# EAGLE design Schéma Ampli n°6 (EAGLE 7.6.0)
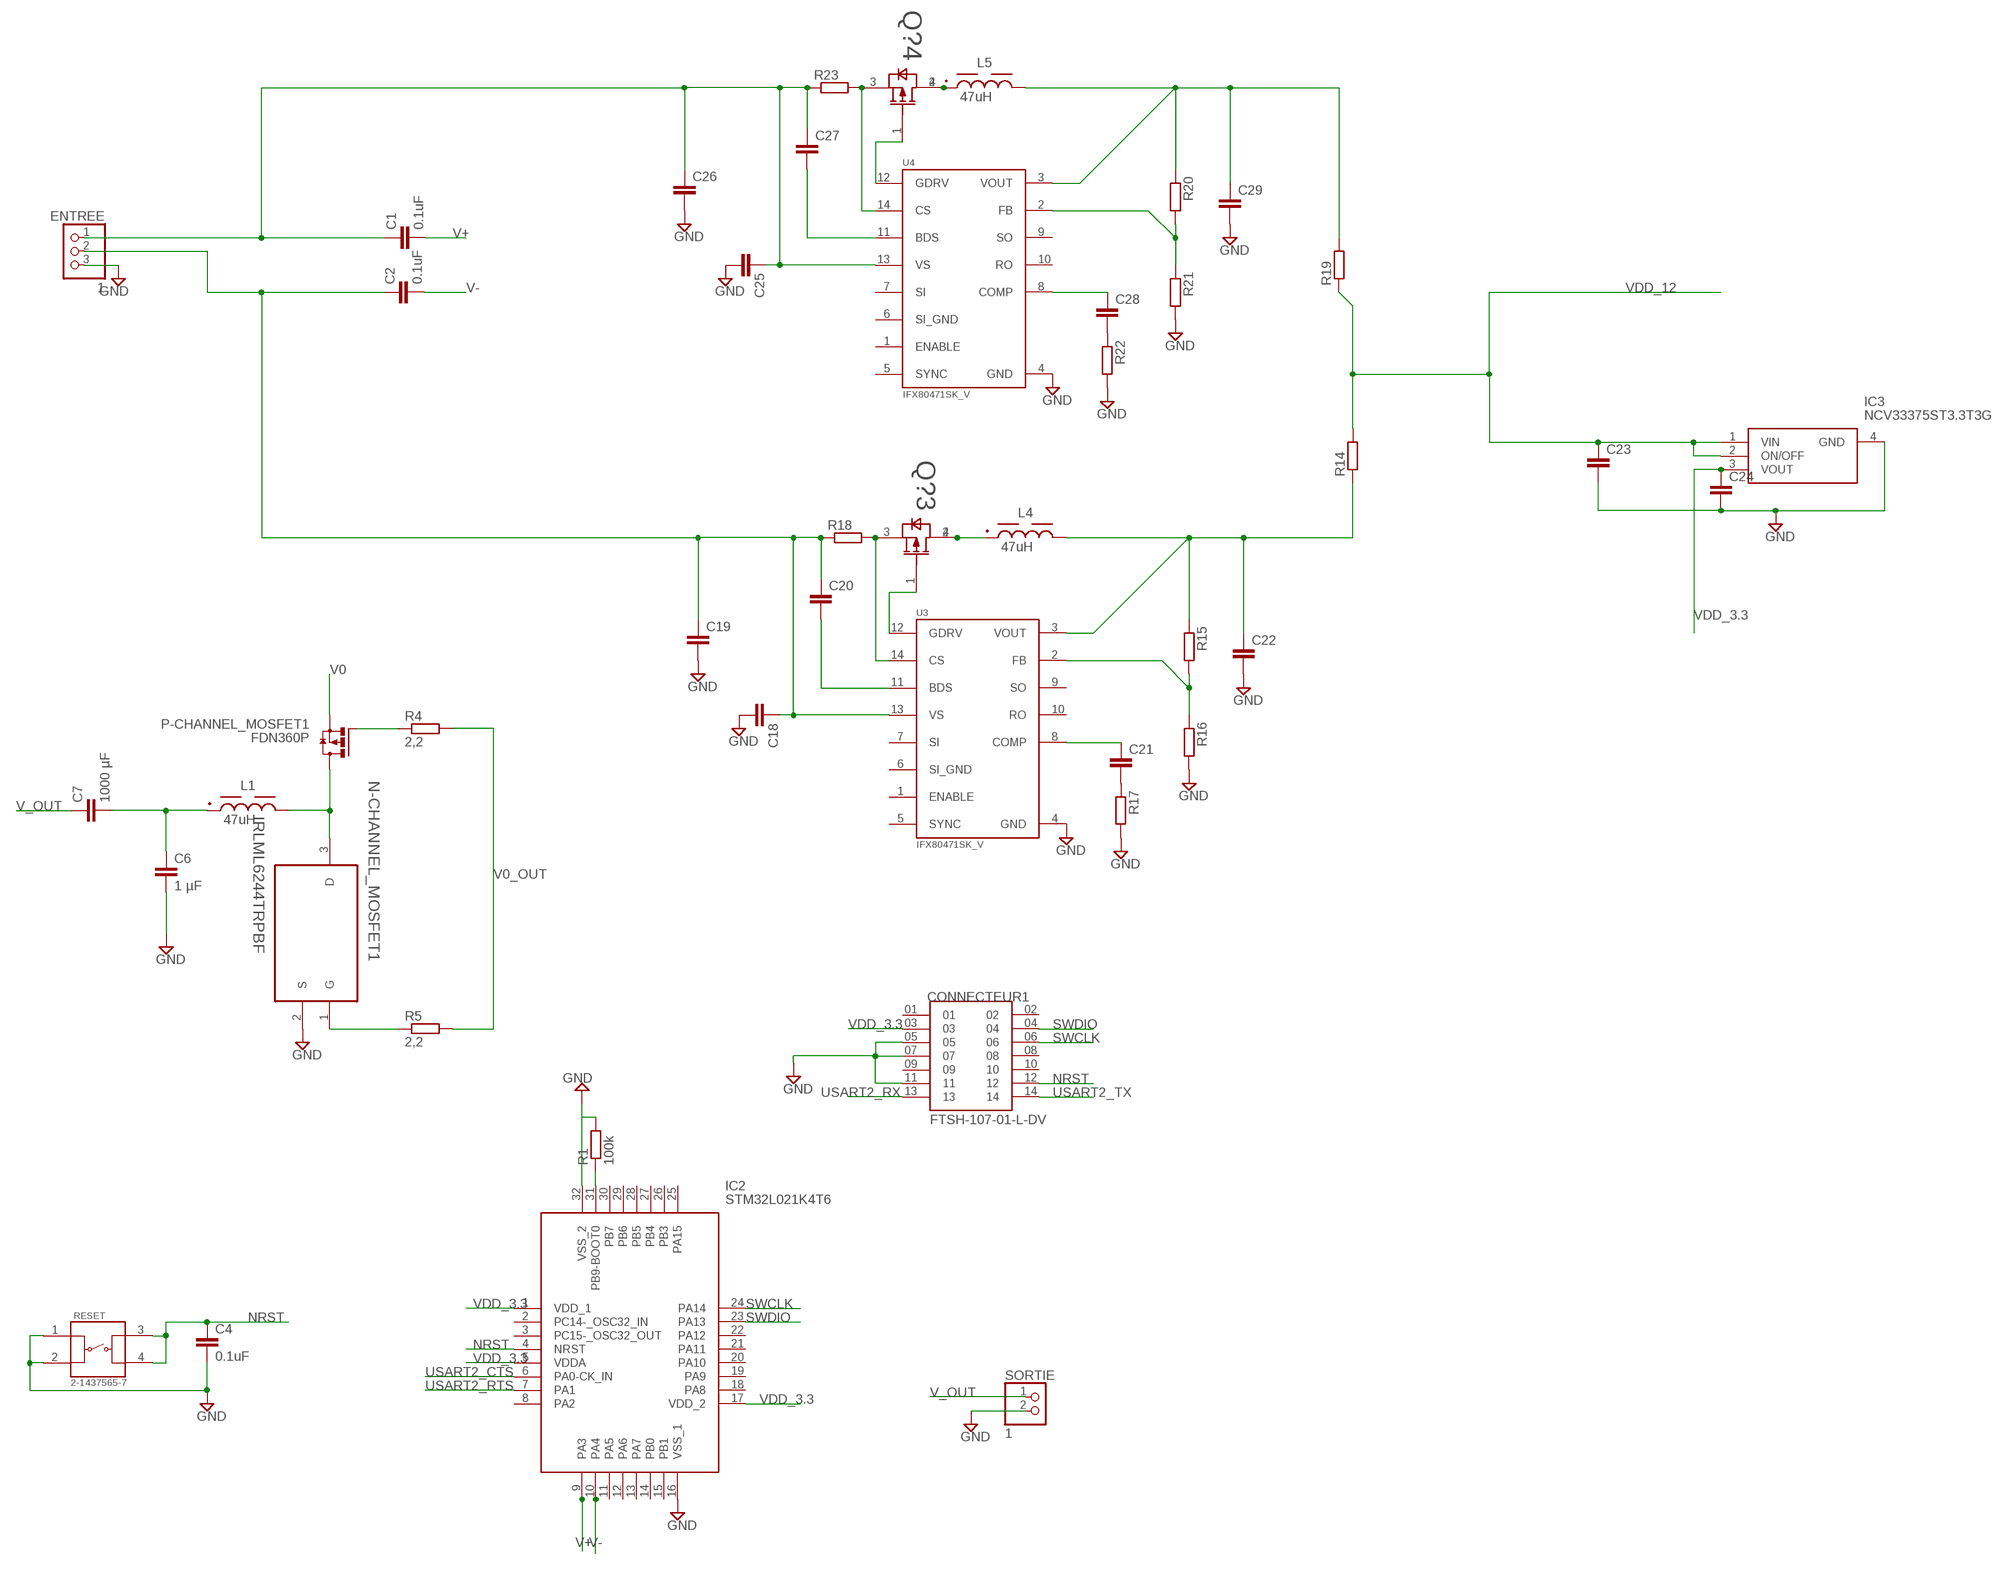
[diagram p0: schematic, sheet 1]

## Parts
C1  0.1uF  C-EUC0603  [C0603]
C2  0.1uF  C-EUC0603  [C0603]
C4  0.1uF  C-EUC0603  [C0603]
C6  1 µF  C-EUC0603  [C0603]
C7  1000 µF  C-EUC0603  [C0603]
C18  C-EUC0603  [C0603]
C19  C-EUC0603  [C0603]
C20  C-EUC0603  [C0603]
C21  C-EUC0603  [C0603]
C22  C-EUC0603  [C0603]
C23  C-EUC0603  [C0603]
C24  C-EUC0603  [C0603]
C25  C-EUC0603  [C0603]
C26  C-EUC0603  [C0603]
C27  C-EUC0603  [C0603]
C28  C-EUC0603  [C0603]
C29  C-EUC0603  [C0603]
CONNECTEUR1  FTSH-107-01-L-DV  [SAMTEC_FTSH-107-01-L-DV]
ENTREE  1  PINHD-1X3  [1X03]
IC2  STM32L021K4T6  [QFP80P900X900X160-32N]
IC3  NCV33375ST3.3T3G  [SOT230P700X175-4N]
L1  47uH  WE-PDA_1210_7847709470  [WE-PDA_1210]
L4  47uH  WE-PDA_1210_7847709470  [WE-PDA_1210]
L5  47uH  WE-PDA_1210_7847709470  [WE-PDA_1210]
N-CHANNEL_MOSFET1  IRLML6244TRPBF  [SOT95P237X112-3N]
P-CHANNEL_MOSFET1  FDN360P  [SUPER-SOT3]
Q?3  BSP613P  [SOT230P700X170-4N]
Q?4  BSP613P  [SOT230P700X170-4N]
R1  100k  R-EU_R0603  [R0603]
R4  2,2  R-EU_R0603  [R0603]
R5  2,2  R-EU_R0603  [R0603]
R14  R-EU_R0603  [R0603]
R15  R-EU_R0603  [R0603]
R16  R-EU_R0603  [R0603]
R17  R-EU_R0603  [R0603]
R18  R-EU_R0603  [R0603]
R19  R-EU_R0603  [R0603]
R20  R-EU_R0603  [R0603]
R21  R-EU_R0603  [R0603]
R22  R-EU_R0603  [R0603]
R23  R-EU_R0603  [R0603]
RESET  2-1437565-7  [SW_2-1437565-7]
SORTIE  1  PINHD-1X2  [1X02]
U3  IFX80471SK_V  [SOIC127P600X175-14N-8]
U4  IFX80471SK_V  [SOIC127P600X175-14N-8]

## Nets
GND: C4.2 C6.2 C18.2 C19.2 C22.2 C23.2 C24.2 C25.2 C26.2 C29.2 CONNECTEUR1.05 CONNECTEUR1.07 CONNECTEUR1.11 ENTREE.3 IC2.16(VSS_1) IC2.32(VSS_2) IC3.4(GND) N-CHANNEL_MOSFET1.2(S) R1.2 R16.2 R17.2 R21.2 R22.2 RESET.1 RESET.2 SORTIE.2 U3.4(GND) U4.4(GND)
N$1: C28.2 R22.1
N$2: IC2.31(PB9-BOOT0) R1.1
N$3: C21.2 R17.1
N$4: C1.1 ENTREE.1
N$5: P-CHANNEL_MOSFET1.1(G) R4.1
N$6: L1.2 N-CHANNEL_MOSFET1.3(D) P-CHANNEL_MOSFET1.3(D)
N$7: C6.1 C7.2 L1.1
N$8: C2.1 ENTREE.2
N$9: N-CHANNEL_MOSFET1.1(G) R5.1
N$27: Q?3.3(SOURCE) R18.2 U3.14(CS)
N$28: Q?3.1(GATE) U3.12(GDRV)
N$29: C20.2 U3.11(BDS)
N$31: L4.1 Q?3.2(DRAIN_1) Q?3.4(DRAIN_2)
N$32: C21.1 U3.8(COMP)
N$33: R15.2 R16.1 U3.2(FB)
N$34: C22.1 L4.2 R14.1 R15.1 U3.3(VOUT)
N$35: Q?4.3(SOURCE) R23.2 U4.14(CS)
N$36: Q?4.1(GATE) U4.12(GDRV)
N$37: C27.2 U4.11(BDS)
N$39: L5.1 Q?4.2(DRAIN_1) Q?4.4(DRAIN_2)
N$40: C28.1 U4.8(COMP)
N$41: R20.2 R21.1 U4.2(FB)
N$42: C29.1 L5.2 R19.2 R20.1 U4.3(VOUT)
NRST: C4.1 CONNECTEUR1.12 IC2.4(NRST) RESET.3 RESET.4
SWCLK: CONNECTEUR1.06 IC2.24(PA14)
SWDIO: CONNECTEUR1.04 IC2.23(PA13)
USART2_CTS: IC2.6(PA0-CK_IN)
USART2_RTS: IC2.7(PA1)
USART2_RX: CONNECTEUR1.13
USART2_TX: CONNECTEUR1.14
V0: P-CHANNEL_MOSFET1.2(S)
V0_OUT: R4.2 R5.2
V+: C1.2 IC2.9(PA3)
V+_IN: C25.1 C26.1 C27.1 R23.1 U4.13(VS)
V-: C2.2 IC2.10(PA4)
V-_IN: C18.1 C19.1 C20.1 R18.1 U3.13(VS)
V_OUT: C7.1 SORTIE.1
VDD_3.3: C24.1 CONNECTEUR1.03 IC2.1(VDD_1) IC2.5(VDDA) IC2.17(VDD_2) IC3.3(VOUT)
VDD_12: C23.1 IC3.1(VIN) IC3.2(ON/OFF) R14.2 R19.1
Unconnected: CONNECTEUR1.01 CONNECTEUR1.02 CONNECTEUR1.08 CONNECTEUR1.09 CONNECTEUR1.10 IC2.2(PC14-_OSC32_IN) IC2.3(PC15-_OSC32_OUT) IC2.8(PA2) IC2.11(PA5) IC2.12(PA6) IC2.13(PA7) IC2.14(PB0) IC2.15(PB1) IC2.18(PA8) IC2.19(PA9) IC2.20(PA10) IC2.21(PA11) IC2.22(PA12) IC2.25(PA15) IC2.26(PB3) IC2.27(PB4) IC2.28(PB5) IC2.29(PB6) IC2.30(PB7) U3.1(ENABLE) U3.5(SYNC) U3.7(SI) U3.9(SO) U3.10(RO) U4.1(ENABLE) U4.5(SYNC) U4.7(SI) U4.9(SO) U4.10(RO)

## Power pins joined to a net without a drawn wire
SI_GND: U3.6(SI_GND) U4.6(SI_GND)

## Library data of the parts
C1 C2 C4 C6 C7 C18-C29 = rcl:C-EU: CAPACITOR, European symbol
CONNECTEUR1 = FTSH-107-01-L-DV:FTSH-107-01-L-DV; MANUFACTURER: Samtec; PARTREV: R; STANDARD: Manufacturer Recommendations
ENTREE = pinhead:PINHD-1X3: PIN HEADER
IC2 = SamacSys_Parts:STM32L021K4T6: ARM Microcontrollers - MCU 16/32-BITS MICROS Source: Datasheet <https://www.st.com/resource/en/datasheet/stm32l021k4.pdf>; DESCRIPTION: ARM Microcontrollers - MCU 16/32-BITS MICROS; HEIGHT: 1.6mm; MANUFACTURER_NAME: STMicroelectronics; MANUFACTURER_PART_NUMBER: STM32L021K4T6; MOUSER_PART_NUMBER: 511-STM32L021K4T6; MOUSER_PRICE-STOCK: https://www.mouser.co.uk/ProductDetail/STMicroelectronics/STM32L021K4T6?qs=dTJS0cRn7ohCWAWNqbLYkA%3D%3D
IC3 = SamacSys_Parts:NCV33375ST3.3T3G: ON SEMICONDUCTOR - NCV33375ST3.3T3G - Fixed LDO Voltage Regulator, 4.3V to 13V, 260mV Dropout, 3.3Vout, 300mAout, SOT-223-4 Source: Datasheet <http://www.onsemi.com/pub/Collateral/MC33375-D.PDF>; DESCRIPTION: ON SEMICONDUCTOR - NCV33375ST3.3T3G - Fixed LDO Voltage Regulator, 4.3V to 13V, 260mV Dropout, 3.3Vout, 300mAout, SOT-223-4; HEIGHT: 1.75mm; MANUFACTURER_NAME: onsemi; MANUFACTURER_PART_NUMBER: NCV33375ST3.3T3G; MOUSER_PART_NUMBER: 863-NCV33375ST3.3T3G; MOUSER_PRICE-STOCK: https://www.mouser.co.uk/ProductDetail/ON-Semiconductor/NCV33375ST33T3G?qs=Pqj8oIac8rWOl%252BM3OwXrOg%3D%3D
L1 L4 L5 = Eagle_WE-PDA (rev20b):WE-PDA_1210: WE-PDA SMD Shielded Power Inductor Characteristics Magnetically shielded version which results in a low leakage field High storage capacity High Saturation currents up to 23 A Very low self-losses at high switching frequency's Wide inductance spectrum available at all sizes Operating Temperature -40 °C up to +125 °C Core Material: NiZn Wire connection: welding technology Applications Multimedia applications Switching regulators with low operating voltages Integrated DC/DC-converter Perfect suitable for switching regulators with extremely high efficiency (> 86 %) Plastic base: Because of the one piece construction these are more suitable for high vibration or shock applications <https://www.we-online.com/catalog/media/o55118v209%20Family_WE-PDA.jpg> Details see: https://www.we-online.com/katalog/en/WE-PDA Updated by Ella Wu 2020-03-18 2020(C) Wurth Elektronik; DATASHEET-URL: https://www.we-online.com/catalog/datasheet/7847709470.pdf; FRES: 6.3MHz; IR: 3.2A; ISAT: 3.5A; MOUNT: SMT; PART-NUMBER: 7847709470; RDC-MAX: 67mOhm; RDC-TYP: 56mOhm
N-CHANNEL_MOSFET1 = IR-IRLML6244TRPBF@E:IRLML6244TRPBF: HEXFET Power MOSFET; MPN: IRLML6244TRPBF; OC_FARNELL: 1864517; OC_NEWARK: 84R9705; PACKAGE: SOT-3; SUPPLIER: International Rectifier
P-CHANNEL_MOSFET1 = transistor-power:FDN360P: Single P-Channel, PowerTrench (R) MOSFET Source: http://www.fairchildsemi.com/ds/FD/FDN360P.pdf
Q?3 Q?4 = BSP613P:BSP613P: BSP613P SOT230P700X170-4N Insulated-Gate Field-Effect Transistor (IGFET), P-Channel, Enhancement, Body Diode, Pin 1 Gate, 2 Drain, 3 Source, 4 Drain, 4 Pins
R1 R4 R5 R14-R23 = rcl:R-EU_: RESISTOR, European symbol
RESET = 2-1437565-7:2-1437565-7: FSM2JSMA=SMT,TACTILE,PB SWITCH Check availability <https://pricing.snapeda.com/parts/FSM2JSMA/TE%20Connectivity/view-part?ref=eda>; AVAILABILITY: In Stock; COMMENT: 2-1437565-7; CONFIGURATION_POLE-THROW: Single Pole - Single Throw; CONTACT_CURRENT_RATING: 50 mA; DESCRIPTION: Tactile Switch SPST-NO Top Actuated Surface Mount; MF: TE Connectivity; MP: FSM2JSMA; PACKAGE: None; PRICE: None; PURCHASE-URL: https://pricing.snapeda.com/search/part/FSM2JSMA/?ref=eda
SORTIE = pinhead:PINHD-1X2: PIN HEADER
U3 U4 = IFX80471SK V:IFX80471SK_V: IFX80471SK V Step-Down DC/DC Controller, Adjustable Version SOIC127P600X175-14N-8

## Board
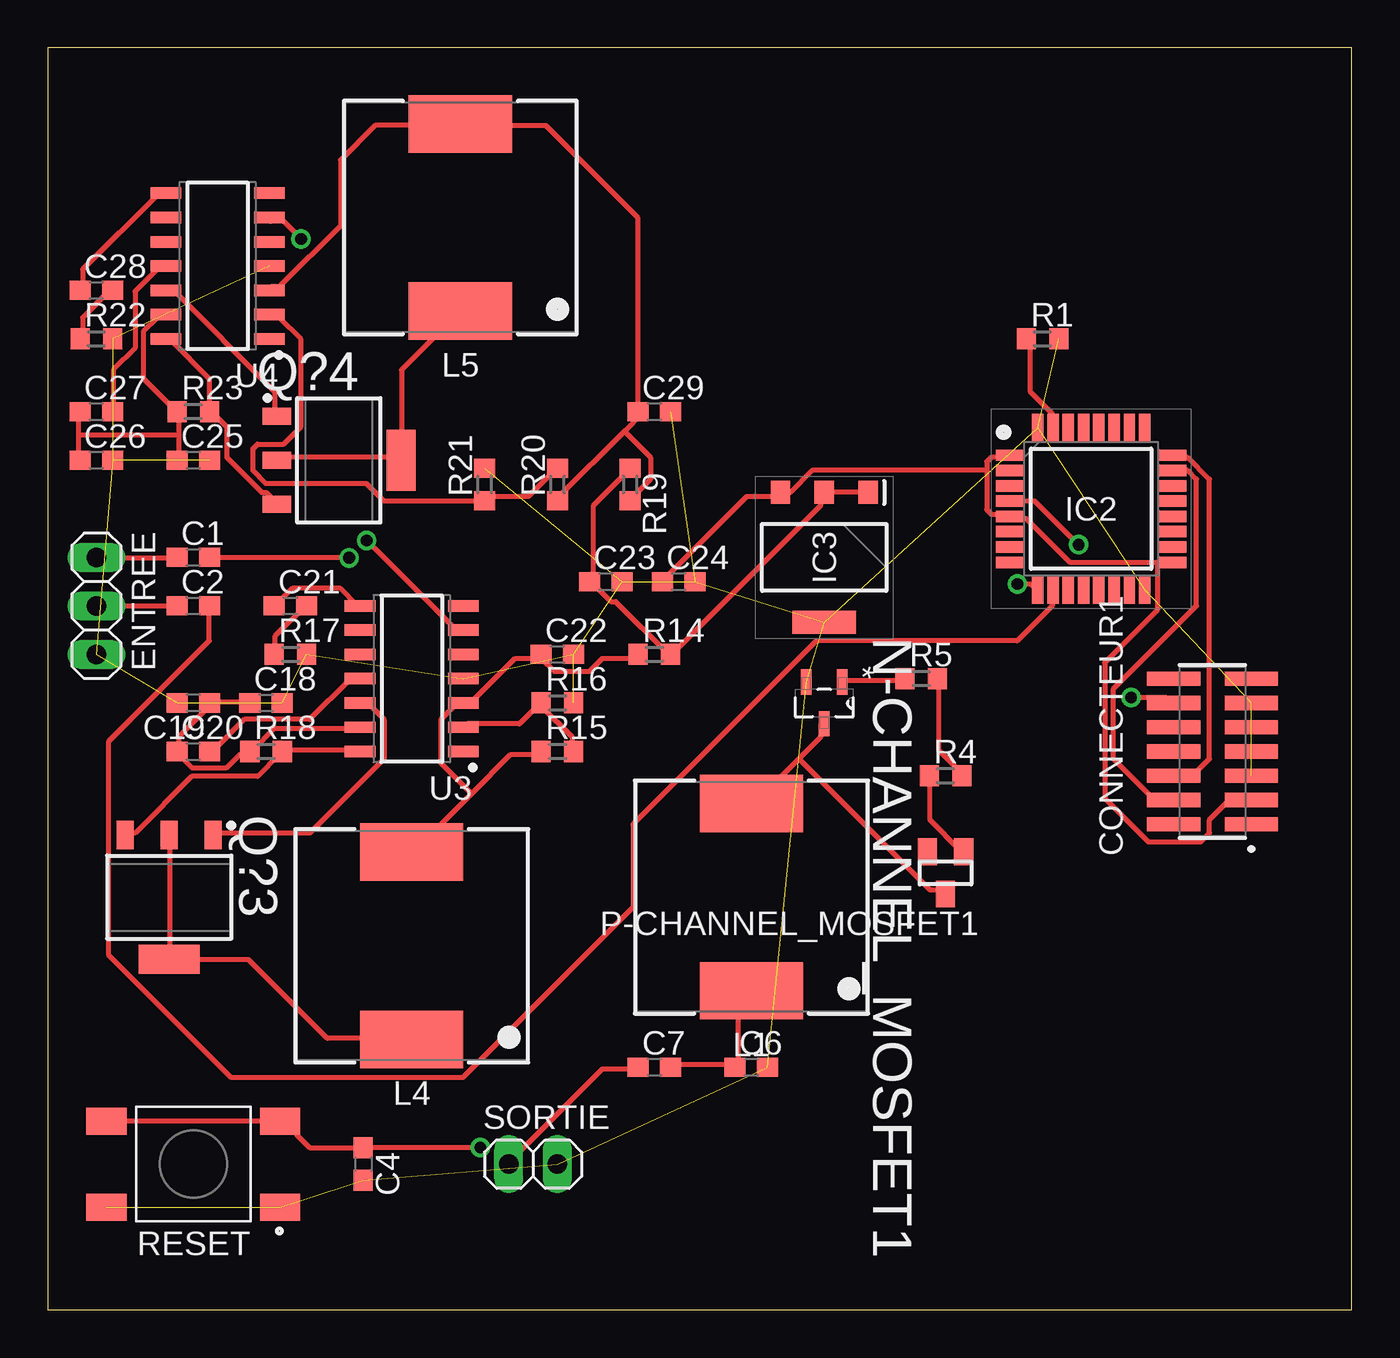
[diagram p1: board, top side]
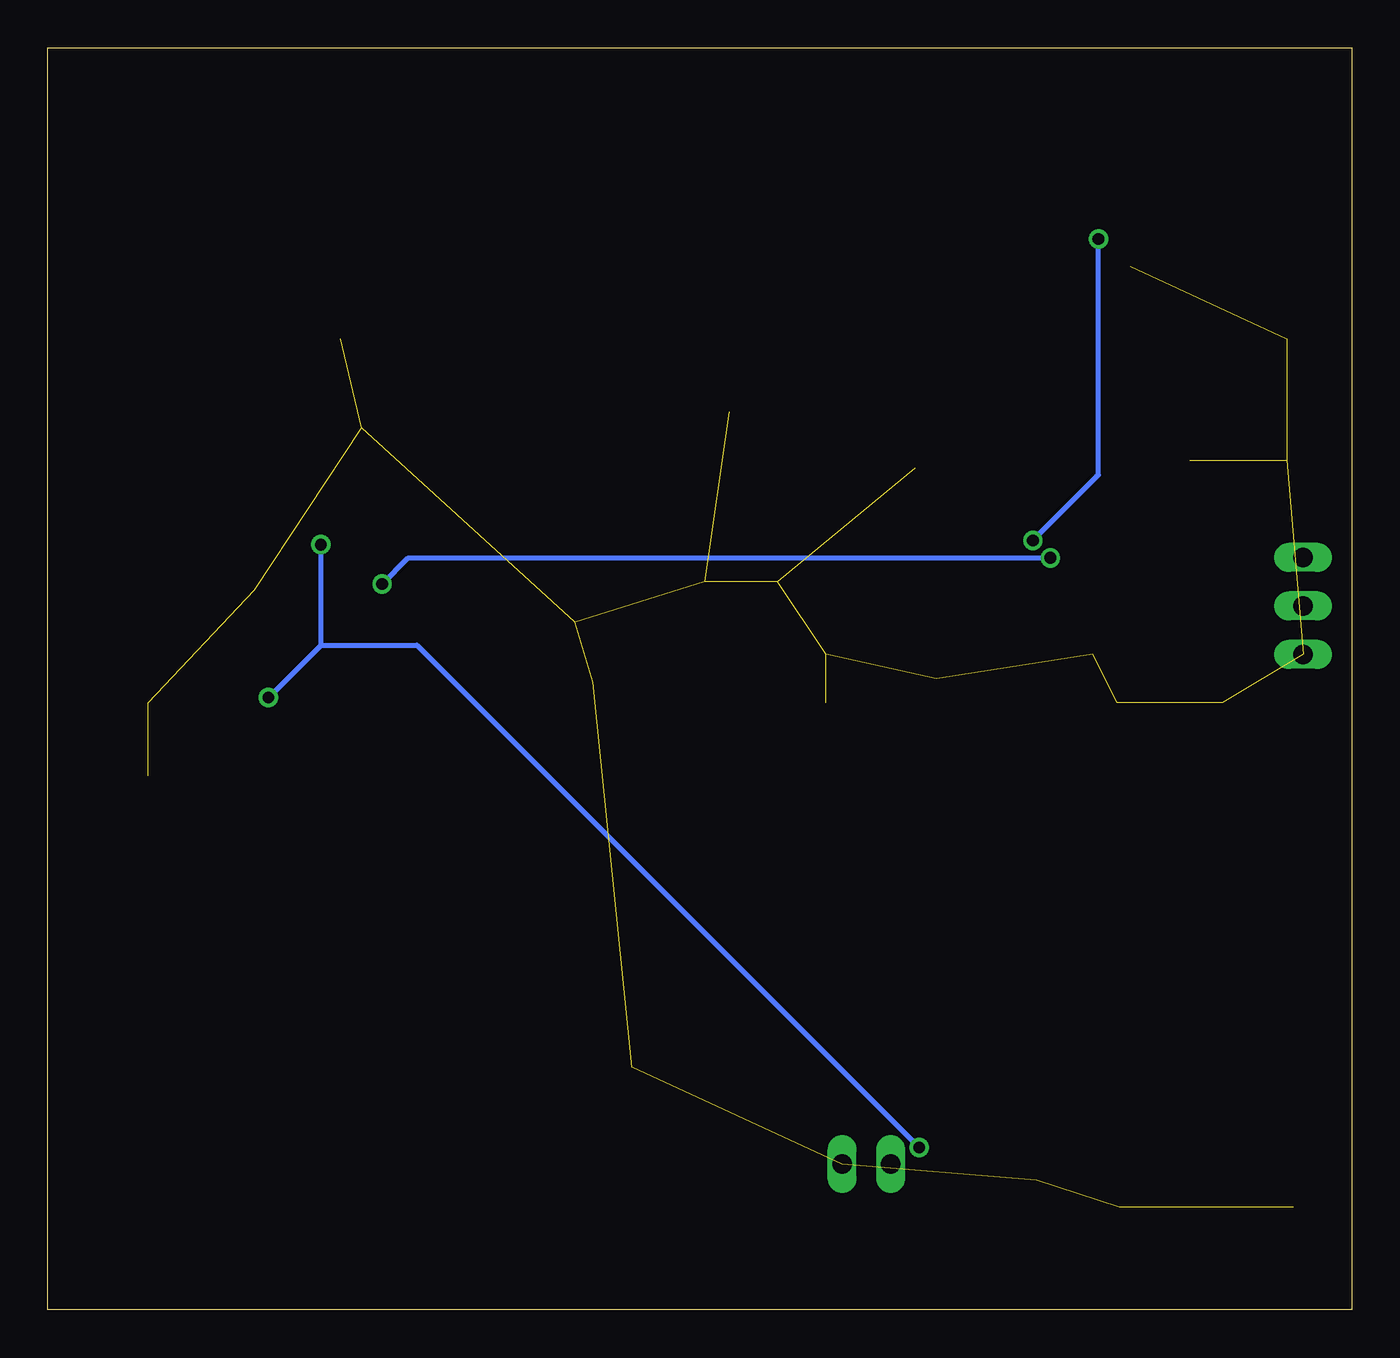
[diagram p2: board, bottom side, seen from below]

Size 68.25 x 66.03 mm. Coordinates in mm from the lower left corner, seen from the top.
Outline: 0,0 68.25,0 68.25,66.03 0,66.03 0,0
Copper layers (1*16): Top 0.035mm / dielectric 1.5mm / Bottom 0.035mm
Design rules "default": minimum track width 10mil, minimum drill 24mil, track to track 8mil, track to pad 8mil, pad to pad 8mil, via to via 8mil, smd to smd 8mil, copper to edge 40mil, drill to drill 8mil, minimum pad ring 10mil, minimum via ring 8mil, stop-mask expansion 4mil, vias tented up to drill 0mil, thermal gap 10mil

### Footprints (pad centres in the part's own frame; a part is rotated, then mirrored left to right if it is on the bottom)
C0603 = smd 1.1 x 1: 1 -0.85,0; 2 0.85,0
SAMTEC_FTSH-107-01-L-DV = smd 0.74 x 2.79: 01 -3.81,-2.035; 02 -3.81,2.035; 03 -2.54,-2.035; 04 -2.54,2.035; 05 -1.27,-2.035; 06 -1.27,2.035; 07 0,-2.035; 08 0,2.035; 09 1.27,-2.035; 10 1.27,2.035; 11 2.54,-2.035; 12 2.54,2.035; 13 3.81,-2.035; 14 3.81,2.035
1X03 = drill 1.016 long: 1 -2.54,0; 2 0,0; 3 2.54,0
QFP80P900X900X160-32N = smd 1.475 x 0.6: 1 -4.238,2.8; 2 -4.238,2; 3 -4.238,1.2; 4 -4.238,0.4; 5 -4.238,-0.4; 6 -4.238,-1.2; 7 -4.238,-2; 8 -4.238,-2.8; 17 4.238,-2.8; 18 4.238,-2; 19 4.238,-1.2; 20 4.238,-0.4; 21 4.238,0.4; 22 4.238,1.2; 23 4.238,2; 24 4.238,2.8 | smd 0.6 x 1.475: 9 -2.8,-4.238; 10 -2,-4.238; 11 -1.2,-4.238; 12 -0.4,-4.238; 13 0.4,-4.238; 14 1.2,-4.238; 15 2,-4.238; 16 2.8,-4.238; 25 2.8,4.238; 26 2,4.238; 27 1.2,4.238; 28 0.4,4.238; 29 -0.4,4.238; 30 -1.2,4.238; 31 -2,4.238; 32 -2.8,4.238
SOT230P700X175-4N = smd 1.2 x 1: 1 -3.4,2.3; 2 -3.4,0; 3 -3.4,-2.3 | smd 1.2 x 3.3: 4 3.4,0
WE-PDA_1210 = smd 5.4 x 3: 1 0,4.9; 2 0,-4.9
SOT95P237X112-3N = smd 1.321 x 0.559: 1 -1.092,0.94; 2 -1.092,-0.94; 3 1.092,0
SUPER-SOT3 = smd 1 x 1.4: 1 -0.95,-1.1; 2 0.95,-1.1; 3 0,1.1
SOT230P700X170-4N = smd 1.5 x 0.9: 1 -3.25,2.3; 2 -3.25,0; 3 -3.25,-2.3 | smd 1.5 x 3.2: 4 3.25,0
R0603 = smd 1 x 1.1: 1 -0.85,0; 2 0.85,0
SW_2-1437565-7 = smd 2.1 x 1.4: 1 -4.55,2.25; 2 4.55,2.25; 3 -4.55,-2.25; 4 4.55,-2.25
1X02 = drill 1.016 long: 1 -1.27,0; 2 1.27,0
SOIC127P600X175-14N-8 = smd 1.6 x 0.6: 1 -2.7,3.81; 2 -2.7,2.54; 3 -2.7,1.27; 4 -2.7,0; 5 -2.7,-1.27; 6 -2.7,-2.54; 7 -2.7,-3.81; 8 2.7,-3.81; 9 2.7,-2.54; 10 2.7,-1.27; 11 2.7,0; 12 2.7,1.27; 13 2.7,2.54; 14 2.7,3.81

### Placement (x,y rotation side)
C1  7.62,39.37 0 top
C2  7.62,36.83 0 top
C4  16.51,7.62 270 top
C6  36.83,12.7 0 top
C7  31.75,12.7 0 top
C18  11.43,31.75 0 top
C19  7.62,31.75 180 top
C20  7.62,29.21 0 top
C21  12.7,36.83 0 top
C22  26.67,34.29 0 top
C23  29.21,38.1 0 top
C24  33.02,38.1 0 top
C25  7.62,44.45 0 top
C26  2.54,44.45 0 top
C27  2.54,46.99 0 top
C28  2.54,53.34 0 top
C29  31.75,46.99 0 top
CONNECTEUR1  60.96,29.21 90 top
ENTREE  2.54,36.83 270 top
IC2  54.61,41.91 0 top
IC3  40.64,39.37 270 top
L1  36.83,21.59 180 top
L4  19.05,19.05 180 top
L5  21.59,57.15 180 top
N-CHANNEL_MOSFET1  40.64,31.75 270 top
P-CHANNEL_MOSFET1  46.99,22.86 180 top
Q?3  6.35,21.59 270 top
Q?4  15.24,44.45 0 top
R1  52.07,50.8 0 top
R4  46.99,27.94 0 top
R5  45.72,33.02 0 top
R14  31.75,34.29 0 top
R15  26.67,29.21 0 top
R16  26.67,31.75 0 top
R17  12.7,34.29 0 top
R18  11.43,29.21 0 top
R19  30.48,43.18 270 top
R20  26.67,43.18 90 top
R21  22.86,43.18 90 top
R22  2.54,50.8 0 top
R23  7.62,46.99 0 top
RESET  7.62,7.62 180 top
SORTIE  25.4,7.62 0 top
U3  19.05,33.02 180 top
U4  8.89,54.61 180 top

### Tracks (layer width: path | path; a pad name or v marks a point on that pad's centre or on a via)
GND  (27 unrouted)
  pour Bottom (isolate 15.24): 0,66.04 67.94,66.04 67.94,0 0,0
  pour Top (isolate 15.24): 0,66.04 67.94,66.04 67.94,0 0,0
N$1
  Top 0.254: R22.1 1.83,51 1.83,51.92 3.2,53.29 C28.2
N$2
  Top 0.254: R1.1 51.44,50.77 51.44,48.03 52.58,46.89 52.58,46.2 IC2.31
N$3
  Top 0.254: R17.1 11.89,34.31 11.89,35.23 13.49,36.83 C21.2
N$4
  Top 0.254: C1.1 6.63,39.34 2.74,39.34 ENTREE.1
N$5
  Top 0.254: R4.1 46.18,27.91 46.18,25.63 47.78,24.03 P-CHANNEL_MOSFET1.1
N$6
  Top 0.254: 39.32,28.83 37.03,26.54 L1.2 | 39.32,28.83 40.46,29.97 40.46,30.66 N-CHANNEL_MOSFET1.3 | 39.32,28.83 46.18,21.97 46.86,21.97 P-CHANNEL_MOSFET1.3
N$7
  Top 0.254: C7.2 32.69,12.83 35.89,12.83 C6.1 36.12,12.83 36.12,15.8 36.8,16.48 L1.1
N$8
  Top 0.254: ENTREE.2 C2.1
N$9
  Top 0.254: R5.1 44.81,32.94 41.6,32.94 N-CHANNEL_MOSFET1.1
N$27
  Top 0.254: U3.14 16.23,29.29 12.34,29.29 R18.2 12.12,29.06 10.97,27.91 7.54,27.91 4.57,24.94 4.12,24.94 Q?3.3
N$28
  Top 0.254: Q?3.1 8.69,24.94 13.72,24.94 17.6,28.83 17.6,30.89 16.92,31.57 16.46,31.57 U3.12
N$29
  Top 0.254: C20.2 8.69,29.29 10.29,30.89 13.72,30.89 15.77,32.94 16.23,32.94 U3.11
N$31
  Top 0.254: Q?3.2 6.4,24.71 6.4,18.54 Q?3.4 6.4,18.31 10.52,18.31 14.63,14.2 18.97,14.2 L4.1
N$32
  Top 0.254: C21.1 11.89,36.83 12.8,37.74 15.32,37.74 16.23,36.83 U3.8
N$33
  Top 0.254: R15.2 27.43,29.29 27.43,29.97 25.83,31.57 R16.1 25.6,31.57 24.69,30.66 21.95,30.66 U3.2
N$34
  Top 0.254: R14.1 30.86,34.09 29.03,34.09 28.35,33.4 26.52,33.4 25.83,34.09 C22.1 25.6,34.09 24.46,34.09 21.95,31.57 U3.3 21.72,31.57 21.26,31.57 20.57,30.89 20.57,28.6 22.17,27 | 22.17,27 19.2,24.03 L4.2 | 22.17,27 24.23,29.06 25.6,29.06 R15.1
N$35
  Top 0.254: U4.14 6.4,50.77 8.46,48.72 8.46,47.12 R23.2 8.69,46.89 9.37,46.2 9.37,44.6 11.2,42.77 11.43,42.77 11.89,42.32 Q?4.3
N$36
  Top 0.254: Q?4.1 11.89,46.89 11.89,48.03 6.4,53.52 U4.12
N$37
  Top 0.254: C27.2 3.43,47.12 3.43,49.17 4.57,50.32 4.57,53.29 5.71,54.43 6.17,54.43 U4.11
N$39
  Top 0.254: Q?4.2 12.12,44.6 18.29,44.6 Q?4.4 18.52,44.6 18.52,49.17 21.49,52.15 L5.1
N$40
  Top 0.254: C28.1 1.83,53.52 1.83,54.43 5.71,58.32 6.17,58.32 U4.8
N$41
  Top 0.254: R20.2 26.52,43.92 25.15,42.55 22.86,42.55 R21.1 22.86,42.32 17.6,42.32 16.69,43.23 11.43,43.23 10.74,43.92 10.74,45.06 10.97,45.29 12.34,45.29 13.26,46.2 13.26,50.77 12.12,51.92 11.66,51.92 U4.2
N$42
  Top 0.254: 30.18,45.97 31.09,46.89 C29.1 30.86,47.12 30.86,57.17 26.06,61.98 21.72,61.98 L5.2 21.49,61.98 17.14,61.98 15.32,60.15 15.32,56.72 12.12,53.52 11.66,53.52 U4.3 | 30.18,45.97 26.75,42.55 R20.1 | 30.18,45.97 31.55,44.6 31.55,43.46 30.63,42.55 R19.2
NRST  (via drill 0.61)
  Top 0.254: RESET.4 3.2,9.86 12.12,9.86 RESET.3 12.34,9.86 13.72,8.48 16.46,8.48 C4.1 16.69,8.48 v22.63,8.48 | v53.95,40.03 51.66,42.32 50.52,42.32 IC2.4 | v56.69,32.03 58.52,32.03 58.75,31.8 CONNECTEUR1.12
  Bottom 0.254: 53.95,34.77 v53.95,40.03 | v56.69,32.03 53.95,34.77 | v22.63,8.48 48.92,34.77 53.95,34.77
SI_GND  (via drill 0.61)
  Top 0.254: v13.26,56.03 12.34,56.95 11.66,56.95 U4.6 | v16.69,40.26 21.26,35.69 21.72,35.69 U3.6
  Bottom 0.254: v13.26,56.03 13.26,43.69 v16.69,40.26
SWCLK
  Top 0.254: IC2.24 58.98,44.6 59.66,44.6 60.81,43.46 60.81,28.83 60.12,28.14 58.98,28.14 CONNECTEUR1.06
SWDIO
  Top 0.254: IC2.23 58.98,43.92 59.66,43.92 60.12,43.46 60.12,36.83 55.78,32.49 55.78,28.83 57.84,26.77 58.75,26.77 CONNECTEUR1.04
V0_OUT
  Top 0.254: R5.2 46.63,32.94 46.63,29.29 47.78,28.14 R4.2
V+  (via drill 0.61)
  Top 0.254: v15.77,39.34 8.69,39.34 C1.2 | v50.75,37.97 51.44,37.97 51.66,37.74 IC2.9
  Bottom 0.254: v15.77,39.34 49.38,39.34 v50.75,37.97
V+_IN
  Top 0.254: 1.6,45.74 1.6,46.89 C27.1 | 1.6,45.74 1.6,44.6 C26.1 | 6.86,45.74 6.86,46.89 R23.1 6.63,47.12 5.03,48.72 5.03,51.23 5.71,51.92 6.17,51.92 U4.13 | 6.86,45.74 6.86,44.6 C25.1 | 6.86,45.74 1.6,45.74
V-
  Top 0.254: C2.2 8.46,36.83 8.46,35 3.2,29.74 3.2,18.54 9.6,12.14 21.72,12.14 30.63,21.06 30.63,25.4 40.23,35 50.75,35 52.58,36.83 52.58,37.52 IC2.10
V-_IN
  Top 0.254: C18.1 10.52,31.8 8.69,31.8 C19.1 8.46,31.57 6.86,29.97 6.86,29.29 C20.1 6.86,29.06 7.54,28.37 9.37,28.37 10.06,29.06 10.52,29.06 R18.1 10.74,29.29 11.89,30.43 16.23,30.43 U3.13
V_OUT
  Top 0.254: C7.1 30.86,12.6 29.03,12.6 24.23,7.8 SORTIE.1
VDD_3.3
  Top 0.254: C24.1 32.23,38.2 36.58,42.55 38.18,42.55 IC3.3 38.41,42.77 38.86,42.77 40.01,43.92 49.15,43.92 | 49.15,43.92 49.15,44.37 49.38,44.6 50.29,44.6 IC2.1 | 49.15,43.92 49.15,41.86 49.38,41.63 50.29,41.63 IC2.5 50.52,41.4 51.21,41.4 53.49,39.12 58.06,39.12 | 58.06,39.12 58.75,39.12 IC2.17 | 58.06,39.12 58.06,36.6 55.32,33.86 55.32,26.77 57.61,24.49 60.35,24.49 60.81,24.94 60.81,25.63 61.72,26.54 62.87,26.54 CONNECTEUR1.03
VDD_12
  Top 0.254: IC3.1 42.75,42.77 40.69,42.77 IC3.2 40.46,42.55 40.46,42.09 32.69,34.31 R14.2 32.46,34.31 29.72,37.06 29.49,37.06 28.57,37.97 C23.1 28.57,38.2 28.57,42.09 30.4,43.92 R19.1